# Altium project DreamLight.PrjPcb
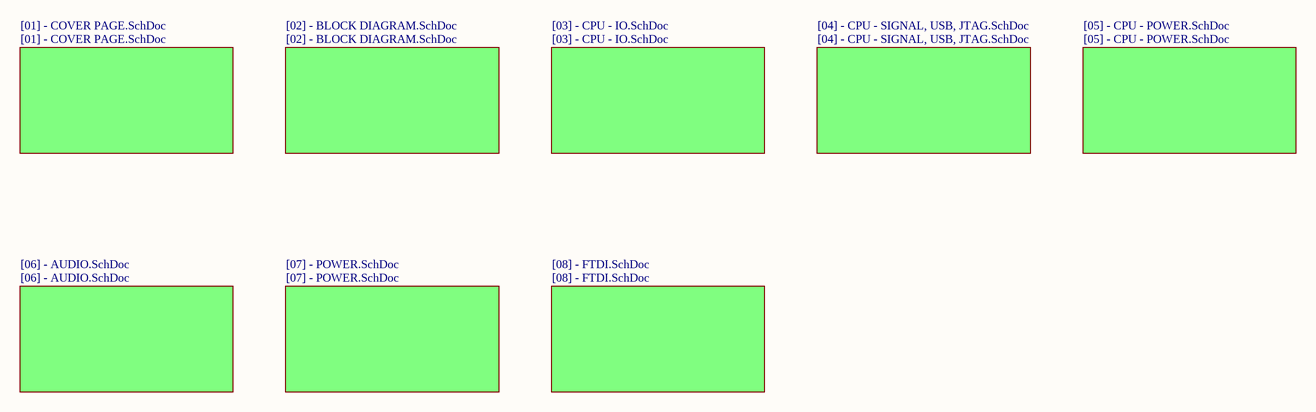
[diagram p0: DreamLight v1.SchDoc]
Title: LKJkljnksdsdv
9 sheets, 126 parts. Net scope: flat (ports and power ports of the same name join across sheets).
Board file: PCB.PcbDoc
Sheets:
  DreamLight v1.SchDoc
    [01] - COVER PAGE.SchDoc = [01] - COVER PAGE.SchDoc
    [02] - BLOCK DIAGRAM.SchDoc = [02] - BLOCK DIAGRAM.SchDoc
    [03] - CPU - IO.SchDoc = [03] - CPU - IO.SchDoc
    [04] - CPU - SIGNAL, USB, JTAG.SchDoc = [04] - CPU - SIGNAL, USB, JTAG.SchDoc
    [05] - CPU - POWER.SchDoc = [05] - CPU - POWER.SchDoc
    [06] - AUDIO.SchDoc = [06] - AUDIO.SchDoc
    [07] - POWER.SchDoc = [07] - POWER.SchDoc
    [08] - FTDI.SchDoc = [08] - FTDI.SchDoc

## Sheet DreamLight v1.SchDoc: DOCUMENT TITLE
size A4; Organization: Tor Brodtkorb; Address1: Frode Rinnans veg 193; Address2: 7050 Trondheim; DocumentNumber: 6598; Revision: 1.0; SheetNumber: 1; SheetTotal: 1

### Sub-sheets
[01] - COVER PAGE.SchDoc = [01] - COVER PAGE.SchDoc: no entries
[02] - BLOCK DIAGRAM.SchDoc = [02] - BLOCK DIAGRAM.SchDoc: no entries
[03] - CPU - IO.SchDoc = [03] - CPU - IO.SchDoc: no entries
[04] - CPU - SIGNAL, USB, JTAG.SchDoc = [04] - CPU - SIGNAL, USB, JTAG.SchDoc: no entries
[05] - CPU - POWER.SchDoc = [05] - CPU - POWER.SchDoc: no entries
[06] - AUDIO.SchDoc = [06] - AUDIO.SchDoc: no entries
[07] - POWER.SchDoc = [07] - POWER.SchDoc: no entries
[08] - FTDI.SchDoc = [08] - FTDI.SchDoc: no entries

### Notes on the sheet
- Title
- Size:
- Date:
- A4
- Number:
- Time:
- Revision:
- Sheet
- of
- File:

## Sheet [01] - COVER PAGE.SchDoc: DOCUMENT TITLE
size A4; Organization: Tor Brodtkorb; Address1: Frode Rinnans veg 193; Address2: 7050 Trondheim; DocumentNumber: 6598; Revision: 1.0; SheetNumber: 1; SheetTotal: 1
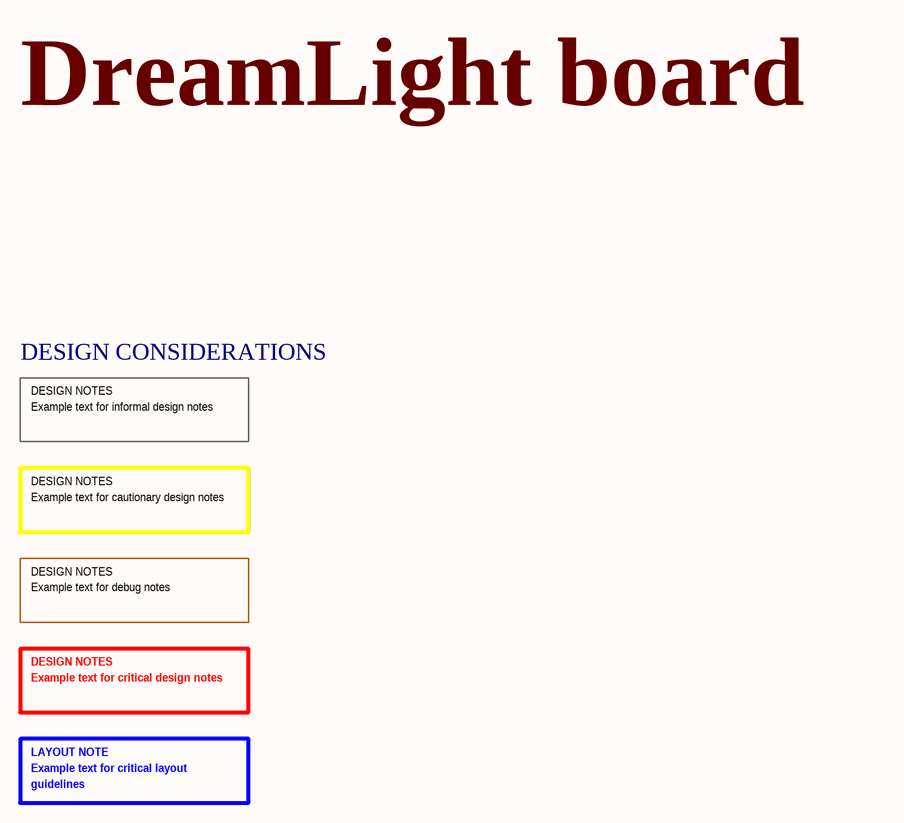
[diagram p1: [01] - COVER PAGE.SchDoc]

### Notes on the sheet
- DreamLight board
- DESIGN CONSIDERATIONS
- DESIGN NOTES
- Example text for informal design notes
- Example text for cautionary design notes
- Example text for debug notes
- Example text for critical design notes
- LAYOUT NOTE
- Example text for critical layout
- guidelines
- Title
- Size:
- Date:
- A4
- Number:
- Time:
- Revision:
- Sheet
- of
- File:

## Sheet [02] - BLOCK DIAGRAM.SchDoc: DOCUMENT TITLE
size A4; Organization: Tor Brodtkorb; Address1: Frode Rinnans veg 193; Address2: 7050 Trondheim; DocumentNumber: 6598; Revision: 1.0; SheetNumber: 1; SheetTotal: 1
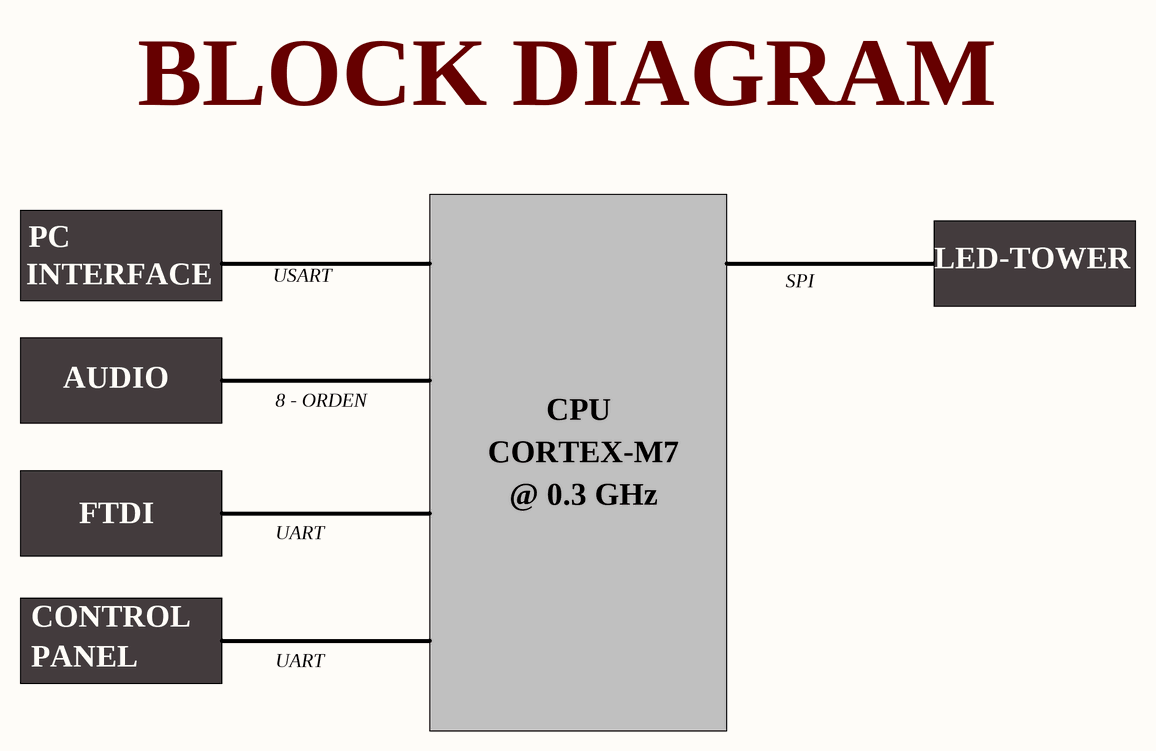
[diagram p2: [02] - BLOCK DIAGRAM.SchDoc]

### Notes on the sheet
- BLOCK DIAGRAM
- PC
- LED-TOWER
- INTERFACE
- USART
- SPI
- AUDIO
- 8 - ORDEN
- CORTEX-M7
- CPU
- FTDI
- UART
- @ 0.3 GHz
- CONTROL
- PANEL
- Title
- Size:
- Date:
- A4
- Number:
- Time:
- Revision:
- Sheet
- of
- File:

## Sheet [03] - CPU - IO.SchDoc: DOCUMENT TITLE
size A4; Organization: Tor Brodtkorb; Address1: Frode Rinnans veg 193; Address2: 7050 Trondheim; DocumentNumber: 6598; Revision: 1.0; SheetNumber: 1; SheetTotal: 1
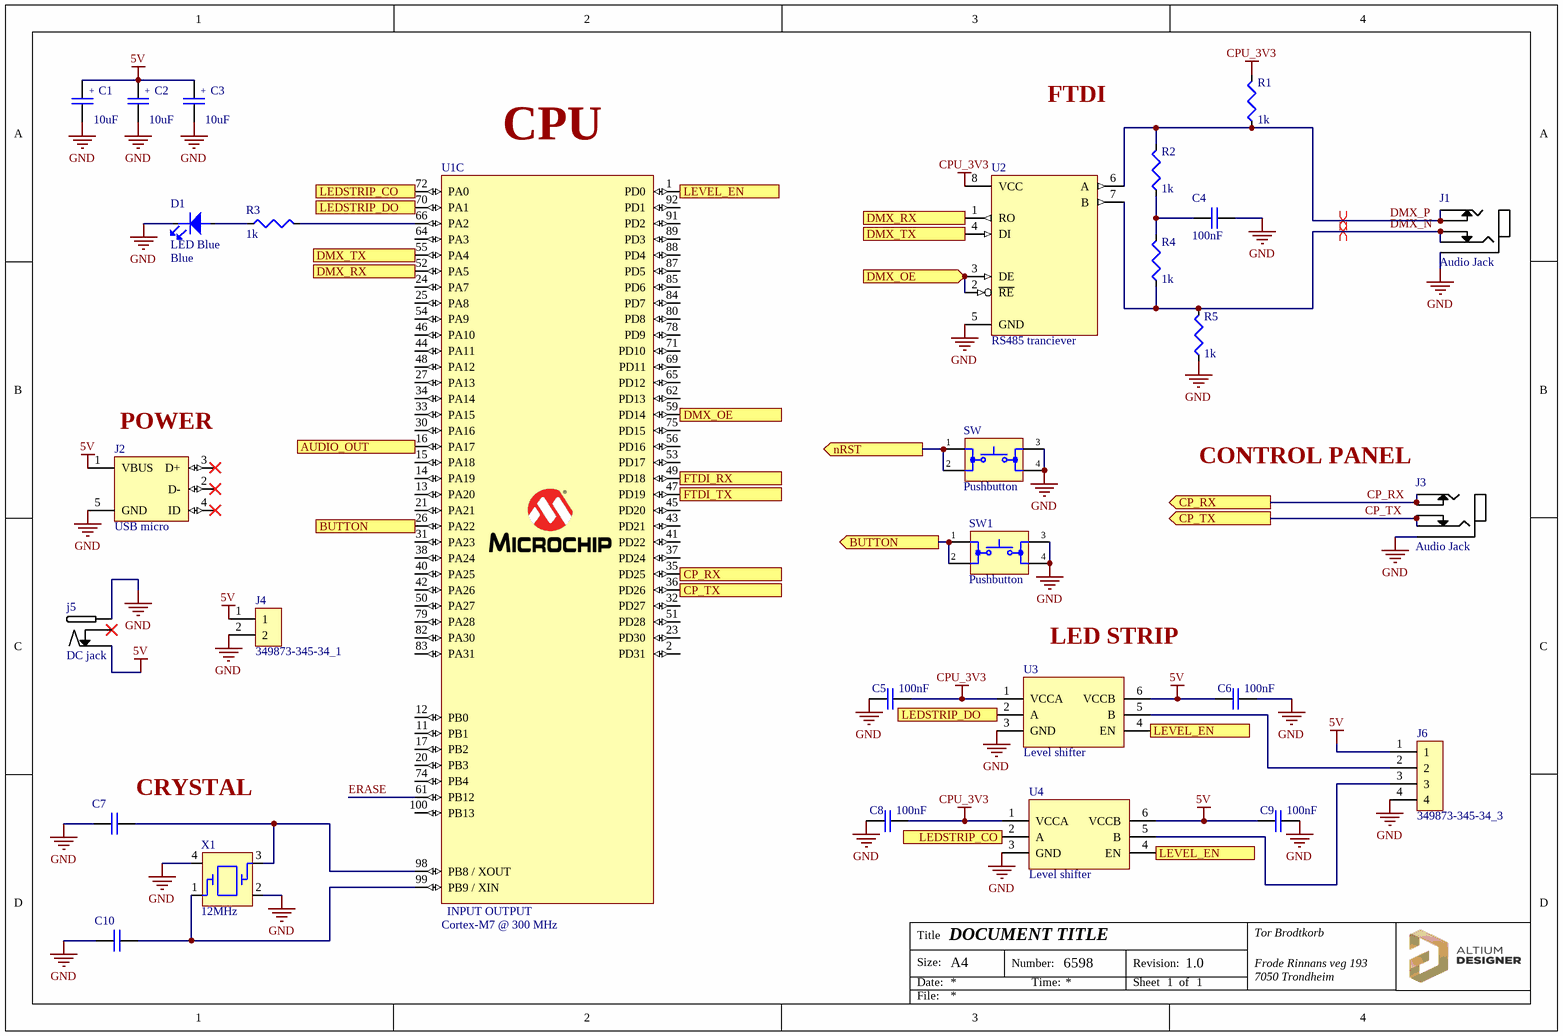
[diagram p3: [03] - CPU - IO.SchDoc]

### Parts
C1  value 10uF  [Capacitor electrolytic SMD 4x5.4]  (hidden comment: EEE1HA2R2SR)
C2  value 10uF  [Capacitor electrolytic SMD 4x5.4]  (hidden comment: EEE1HA2R2SR)
C3  value 10uF  [Capacitor electrolytic SMD 4x5.4]  (hidden comment: EEE1HA2R2SR)
C4  value 100nF  [C0603]  (hidden comment: 02016D104KAT2A)
C5  value 100nF  [C0603]  (hidden comment: 02016D104KAT2A)
C6  value 100nF  [C0603]  (hidden comment: 02016D104KAT2A)
C7  02016D104KAT2A  [C0603]  (value not drawn)
C8  value 100nF  [C0603]  (hidden comment: 02016D104KAT2A)
C9  value 100nF  [C0603]  (hidden comment: 02016D104KAT2A)
C10  02016D104KAT2A  [C0603]  (value not drawn)
D1  LED Blue  Color: Blue  [L0603 BLUE]
J1  Audio Jack  [Audio jack flat]
J2  USB micro  [USB micro]
J3  Audio Jack  [Audio jack flat]
J4  349873-345-34_1  [Header 1x2 male]
j5  DC jack  [DC power jack]
J6  349873-345-34_3  [Header 1x4 male]
R1  value 1k  [R0603]  (hidden comment: CPF-A-0603B100KE1)
R2  value 1k  [R0603]  (hidden comment: CPF-A-0603B100KE1)
R3  value 1k  [R0603]  (hidden comment: CPF-A-0603B100KE1)
R4  value 1k  [R0603]  (hidden comment: CPF-A-0603B100KE1)
R5  value 1k  [R0603]  (hidden comment: CPF-A-0603B100KE1)
SW  Pushbutton  [KSC222G LFS]
SW1  Pushbutton  [KSC222G LFS]
U1  Cortex-M7 @ 300 MHz  [ATSAMS70N19A-AN]  (part C of 3)
U2  RS485 tranciever  [SP3485EN]
U3  Level shifter  [ADG3301BKSZ]
U4  Level shifter  [ADG3301BKSZ]
X1  12MHz  [MCSJK-7U-12.00-12-30-80-B-30]

### Ports
AUDIO_OUT (in), BUTTON (in), BUTTON (out), CP_RX (out), CP_TX (out), DMX_OE (in), DMX_OE (out), DMX_RX (in), DMX_RX (out), DMX_TX (in), DMX_TX (out), FTDI_RX (out), FTDI_TX (out), LEDSTRIP_CO (in), LEDSTRIP_CO (out), LEDSTRIP_DO (in), LEDSTRIP_DO (out), LEVEL_EN (in), LEVEL_EN (out), nRST (out)

### Nets
5V: C1.1 C2.1 C3.1 C6.1 C9.1 J2.1(VBUS) J4.1 j5.1 J6.1 U3.6(VCCB) U4.6(VCCB)
CPU_3V3: C5.2 C8.2 R1.2 U2.8(VCC) U3.1(VCCA) U4.1(VCCA)
GND: C1.2 C2.2 C3.2 C4.1 C5.1 C6.2 C7.2 C8.1 C9.2 C10.2 D1.2 J1.1 J2.5(GND) J3.1 J4.2 j5.3 J6.4 R5.1 SW.3 SW.4 SW1.3 SW1.4 U2.5(GND) U3.3(GND) U4.3(GND) X1.2 X1.4
CP_RX: J3.4 J3.5 U1.35(PD25) ; port CP_RX
CP_TX: J3.2 J3.3 U1.36(PD26) ; port CP_TX
DMX_N: J1.2 J1.3 R4.1 R5.2 U2.7(B)
DMX_P: J1.4 J1.5 R1.1 R2.2 U2.6(A)
ERASE: U1.61(PB12)
nRST: SW.1 SW.2 ; port nRST
NetC4_2: C4.2 R2.1 R4.2
NetC7_1: C7.1 U1.98(PB8_/_XOUT) X1.3
NetC10_1: C10.1 U1.99(PB9_/_XIN) X1.1
NetC55_2: U1.16(PA17) ; port AUDIO_OUT
NetD1_1: D1.1 R3.1
NetJ6_2: J6.2 U3.5(B)
NetJ6_3: J6.3 U4.5(B)
NetR3_2: R3.2 U1.66(PA2)
NetSW1_1: SW1.1 SW1.2 U1.26(PA22) ; port BUTTON
NetU1_1: U1.1(PD0) U3.4(EN) U4.4(EN) ; port LEVEL_EN
NetU1_47: U1.47(PD19) ; port FTDI_TX
NetU1_49: U1.49(PD18) ; port FTDI_RX
NetU1_52: U1.52(PA5) U2.1(RO) ; port DMX_RX
NetU1_55: U1.55(PA4) U2.4(DI) ; port DMX_TX
NetU1_59: U1.59(PD14) U2.2(~{RE}) U2.3(DE) ; port DMX_OE
NetU1_70: U1.70(PA1) U3.2(A) ; port LEDSTRIP_DO
NetU1_72: U1.72(PA0) U4.2(A) ; port LEDSTRIP_CO

Not connected (* = marked no-connect by the designer): J2 2(D-)* 3(D+)* 4(ID)*; j5 2*; U1 2(PD31) 11(PB1) 12(PB0) 13(PA20) 14(PA19) 15(PA18) 17(PB2) 20(PB3) 21(PA21) 23(PD30) 24(PA7) 25(PA8) 27(PA13) 30(PA16) 31(PA23) 32(PD27) 33(PA15) 34(PA14) 37(PD24) 38(PA24) 40(PA25) 41(PD22) 42(PA26) 43(PD21) 44(PA11) 45(PD20) 46(PA10) 48(PA12) 50(PA27) 51(PD28) 53(PD17) 54(PA9) 56(PD16) 62(PD13) 64(PA3) 65(PD12) 69(PD11) 71(PD10) 74(PB4) 75(PD15) 78(PD9) 79(PA28) 80(PD8) 82(PA30) 83(PA31) 84(PD7) 85(PD6) 87(PD5) 88(PD4) 89(PD3) 91(PD2) 92(PD1) 100(PB13)

### Layout directives
differential pair: DMX_N, DMX_P

### Notes on the sheet
- FTDI
- (near U1) CPU
- (near J2) POWER
- CONTROL PANEL
- LED STRIP
- (near C7) CRYSTAL
- Title
- Size:
- Date:
- A4
- Number:
- Time:
- Revision:
- Sheet
- of
- File:
- (in symbol ATSAMS70N19A-AN, part C) INPUT OUTPUT
- (in symbol EEE1HA2R2SR) +

### Library data of the parts
C1-C3 = EEE1HA2R2SR: El. Capacitor SMD 4x5.4
C4-C10 = 02016D104KAT2A: C0603
D1 = HSMG-C199: LED 0603 Blue
J1 J3 = FC68133: Audio jack flat 5 contacts; Supplier Part Number 1: 2518190; Supplier 1: Farnell
J2 = 47590-0001: Supplier Part Number 1: 1568022; Supplier 1: Farnell
J4 = 349873-345-34_1: Header 1x2 male 2.54mm
j5 = 694106301002: DC power jack
J6 = 349873-345-34_3: Header 1x4 male 2.54mm
R1-R5 = CPF-A-0603B100KE1: R0603
SW SW1 = KSC222G LFS: Pushbutton SMD; Supplier Part Number 1: 2845714; Supplier 1: Farnell
U1 = ATSAMS70N19A-AN: ATSAMS70N19; Supplier Part Number 1: 2484390; Supplier 1: Farnell
U2 = SP3485EN: RS485 tranciever 3V3
U3 U4 = ADG3301BKSZ: Level shifter 1-bit bidirectional
X1 = MCSJK-7U-12.00-12-30-80-B-30: Crystal 12MHz 3.2mm x 2.5mm; Supplier Part Number 1: 2853917; Supplier 1: Farnell

## Sheet [04] - CPU - SIGNAL, USB, JTAG.SchDoc: DOCUMENT TITLE
size A4; Organization: Tor Brodtkorb; Address1: Frode Rinnans veg 193; Address2: 7050 Trondheim; DocumentNumber: 6598; Revision: 1.0; SheetNumber: 1; SheetTotal: 1
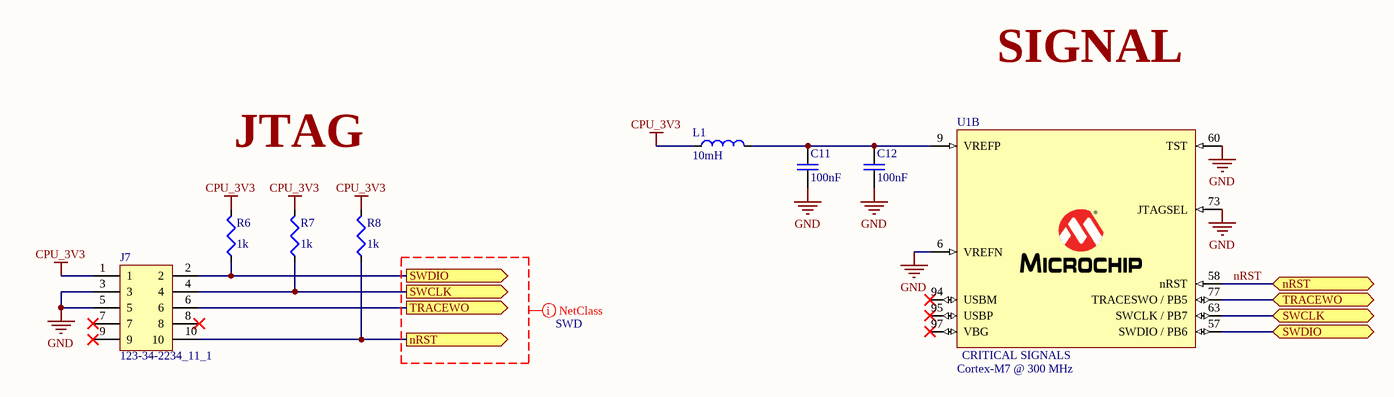
[diagram p4: [04] - CPU - SIGNAL, USB, JTAG.SchDoc]

### Parts
C11  value 100nF  [C0603]  (hidden comment: 02016D104KAT2A)
C12  value 100nF  [C0603]  (hidden comment: 02016D104KAT2A)
J7  123-34-2234_11_1  [Header 2x5 male 1.27mm]
L1  value 10mH  [Inductor 0603]  (hidden comment: MLZ1608A2R2WT)
R6  value 1k  [R0603]  (hidden comment: CPF-A-0603B100KE1)
R7  value 1k  [R0603]  (hidden comment: CPF-A-0603B100KE1)
R8  value 1k  [R0603]  (hidden comment: CPF-A-0603B100KE1)
U1  Cortex-M7 @ 300 MHz  [ATSAMS70N19A-AN]  (part B of 3)

### Ports
nRST (bidir), nRST (out), SWCLK (bidir), SWCLK (out), SWDIO (bidir), SWDIO (out), TRACEWO (bidir), TRACEWO (out)

### Nets
CPU_3V3: J7.1 L1.1 R6.2 R7.2 R8.2
GND: C11.1 C12.1 J7.3 J7.5 U1.6(VREFN) U1.60(TST) U1.73(JTAGSEL)
nRST: J7.10 R8.1 U1.58(nRST) ; port nRST
NetC11_2: C11.2 C12.2 L1.2 U1.9(VREFP)
NetJ7_2: J7.2 R6.1 U1.57(SWDIO_/_PB6) ; port SWDIO
NetJ7_4: J7.4 R7.1 U1.63(SWCLK_/_PB7) ; port SWCLK
NetJ7_6: J7.6 U1.77(TRACESWO_/_PB5) ; port TRACEWO

Not connected (* = marked no-connect by the designer): J7 7* 8* 9*; U1 94(USBM)* 95(USBP)* 97(VBG)*

### Layout directives
net class SWD: (no net found under the mark)

### Notes on the sheet
- SIGNAL
- JTAG
- Title
- Size:
- Date:
- A4
- Number:
- Time:
- Revision:
- Sheet
- of
- File:
- (in symbol ATSAMS70N19A-AN, part B) CRITICAL SIGNALS

### Library data of the parts
C11 C12 = 02016D104KAT2A: C0603
J7 = 123-34-2234_11_1: Header 2x5 male 1.27mm
L1 = MLZ1608A2R2WT: Inductor 0603
R6-R8 = CPF-A-0603B100KE1: R0603
U1 = ATSAMS70N19A-AN: ATSAMS70N19; Supplier Part Number 1: 2484390; Supplier 1: Farnell

## Sheet [05] - CPU - POWER.SchDoc: DOCUMENT TITLE
size A4; Organization: Tor Brodtkorb; Address1: Frode Rinnans veg 193; Address2: 7050 Trondheim; DocumentNumber: 6598; Revision: 1.0; SheetNumber: 1; SheetTotal: 1
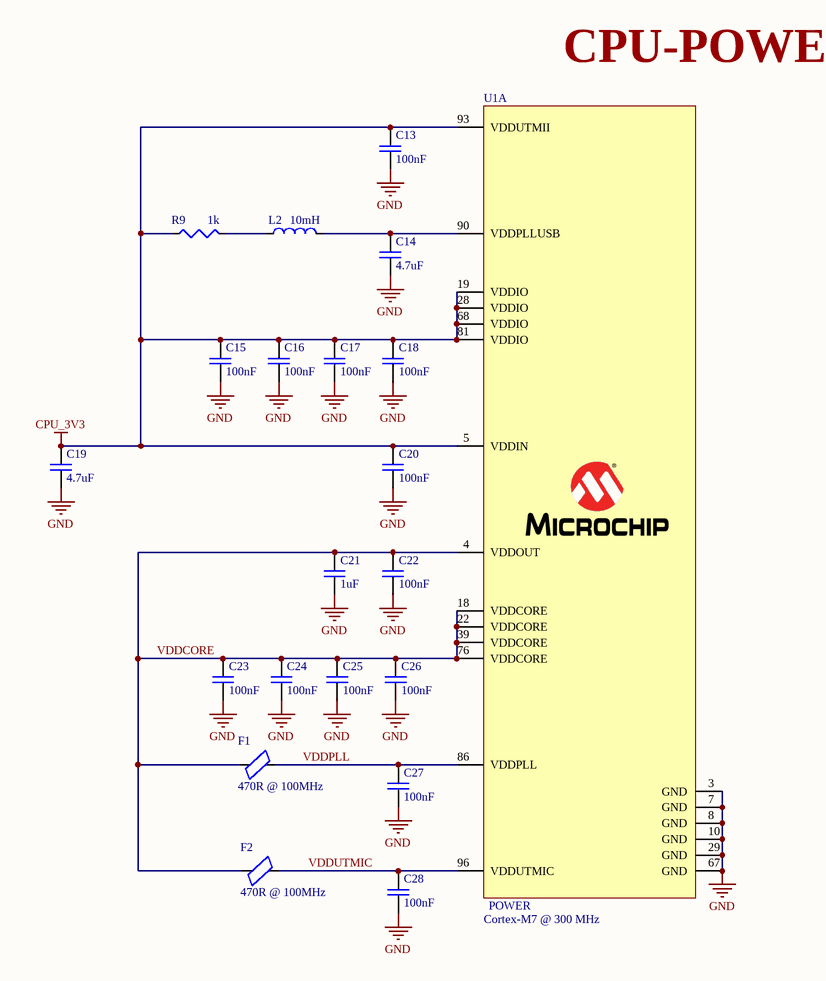
[diagram p5: [05] - CPU - POWER.SchDoc]

### Parts
C13  value 100nF  [C0603]  (hidden comment: 02016D104KAT2A)
C14  value 4.7uF  [C0603]  (hidden comment: 02016D104KAT2A)
C15  value 100nF  [C0603]  (hidden comment: 02016D104KAT2A)
C16  value 100nF  [C0603]  (hidden comment: 02016D104KAT2A)
C17  value 100nF  [C0603]  (hidden comment: 02016D104KAT2A)
C18  value 100nF  [C0603]  (hidden comment: 02016D104KAT2A)
C19  value 4.7uF  [C0603]  (hidden comment: 02016D104KAT2A)
C20  value 100nF  [C0603]  (hidden comment: 02016D104KAT2A)
C21  value 1uF  [C0603]  (hidden comment: 02016D104KAT2A)
C22  value 100nF  [C0603]  (hidden comment: 02016D104KAT2A)
C23  value 100nF  [C0603]  (hidden comment: 02016D104KAT2A)
C24  value 100nF  [C0603]  (hidden comment: 02016D104KAT2A)
C25  value 100nF  [C0603]  (hidden comment: 02016D104KAT2A)
C26  value 100nF  [C0603]  (hidden comment: 02016D104KAT2A)
C27  value 100nF  [C0603]  (hidden comment: 02016D104KAT2A)
C28  value 100nF  [C0603]  (hidden comment: 02016D104KAT2A)
F1  value 470R @ 100MHz  [Ferrite bead 0603]  (hidden comment: BLM18AG121SN1D)
F2  value 470R @ 100MHz  [Ferrite bead 0603]  (hidden comment: BLM18AG121SN1D)
L2  value 10mH  [Inductor 0603]  (hidden comment: MLZ1608A2R2WT)
R9  value 1k  [R0603]  (hidden comment: CPF-A-0603B100KE1)
U1  Cortex-M7 @ 300 MHz  [ATSAMS70N19A-AN]  (part A of 3)

### Nets
CPU_3V3: C13.2 C15.2 C16.2 C17.2 C18.2 C19.2 C20.2 R9.1 U1.5(VDDIN) U1.19(VDDIO) U1.28(VDDIO) U1.68(VDDIO) U1.81(VDDIO) U1.93(VDDUTMII)
GND: C13.1 C14.1 C15.1 C16.1 C17.1 C18.1 C19.1 C20.1 C21.1 C22.1 C23.1 C24.1 C25.1 C26.1 C27.1 C28.1 U1.3(GND) U1.7(GND) U1.8(GND) U1.10(GND) U1.29(GND) U1.67(GND)
VDDCORE: C21.2 C22.2 C23.2 C24.2 C25.2 C26.2 F1.1 F2.1 U1.4(VDDOUT) U1.18(VDDCORE) U1.22(VDDCORE) U1.39(VDDCORE) U1.76(VDDCORE)
VDDPLL: C27.2 F1.2 U1.86(VDDPLL)
VDDUTMIC: C28.2 F2.2 U1.96(VDDUTMIC)
NetC14_2: C14.2 L2.2 U1.90(VDDPLLUSB)
NetL2_1: L2.1 R9.2

### Notes on the sheet
- (near U1) CPU-POWER
- Title
- Size:
- Date:
- A4
- Number:
- Time:
- Revision:
- Sheet
- of
- File:
- (in symbol ATSAMS70N19A-AN, part A) POWER

### Library data of the parts
C13-C28 = 02016D104KAT2A: C0603
F1 F2 = BLM18AG121SN1D: Ferrite bead 0603
L2 = MLZ1608A2R2WT: Inductor 0603
R9 = CPF-A-0603B100KE1: R0603
U1 = ATSAMS70N19A-AN: ATSAMS70N19; Supplier Part Number 1: 2484390; Supplier 1: Farnell

## Sheet [06] - AUDIO.SchDoc: DOCUMENT TITLE
size A3; Organization: Tor Brodtkorb; Address1: Frode Rinnans veg 193; Address2: 7050 Trondheim; DocumentNumber: 6598; Revision: 1.0; SheetNumber: 1; SheetTotal: 1
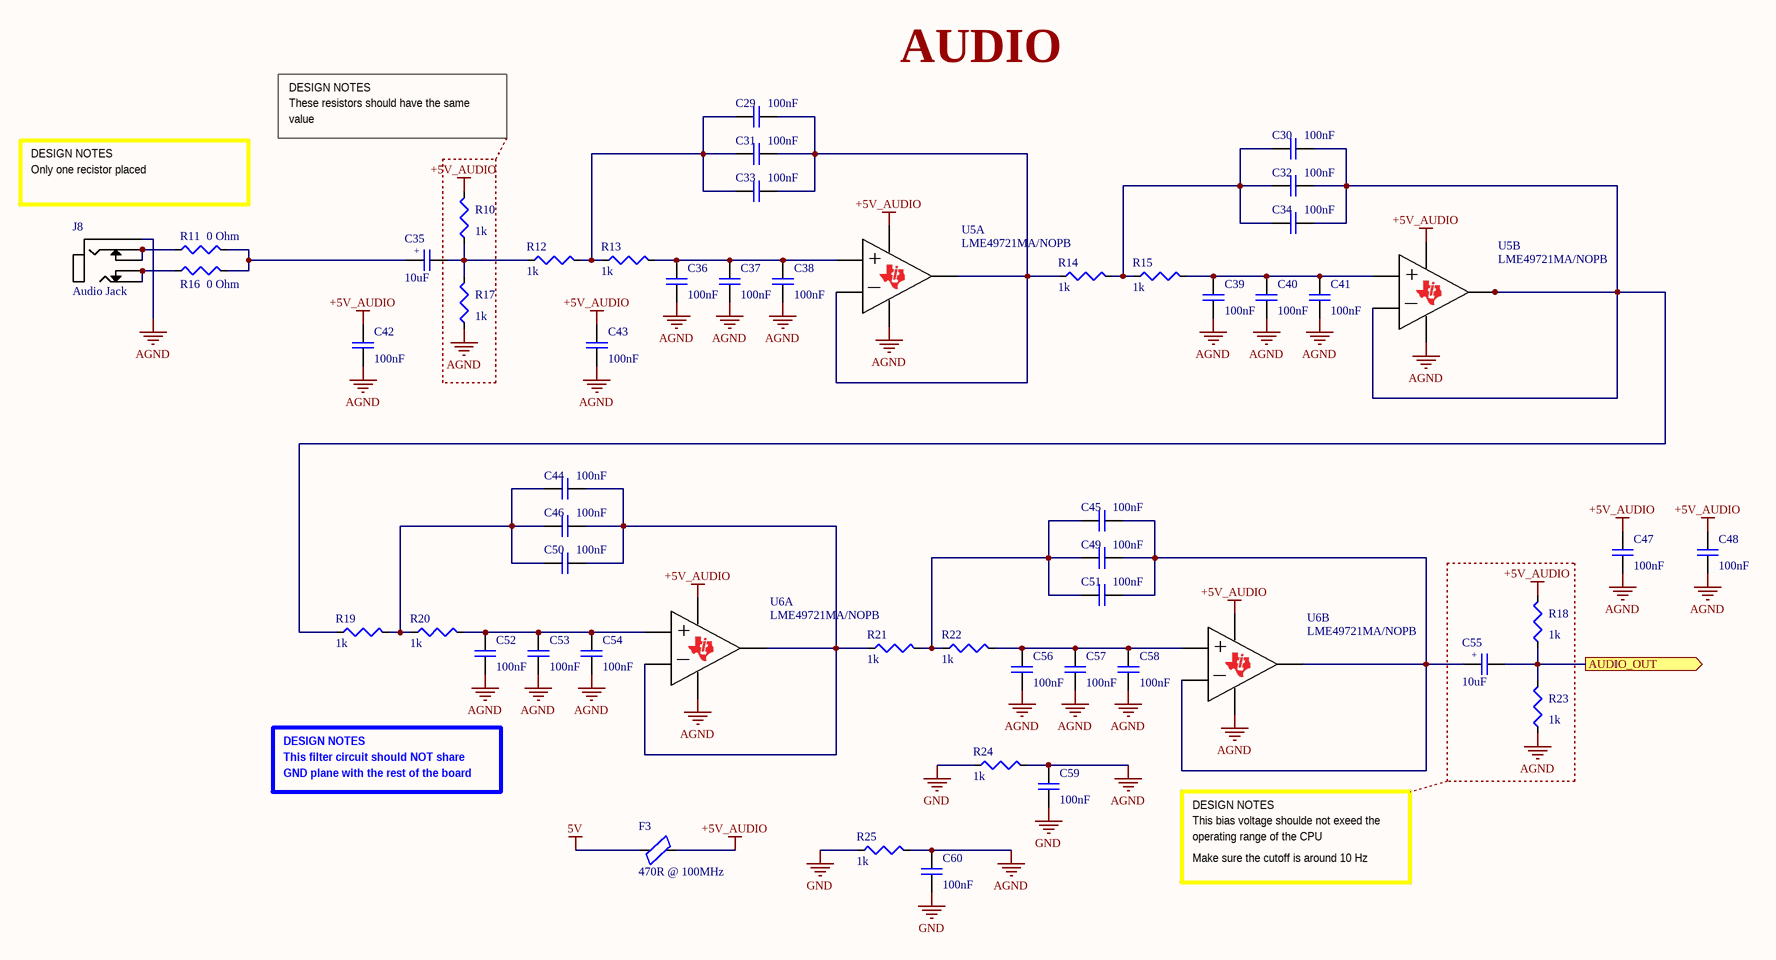
[diagram p6: [06] - AUDIO.SchDoc]

### Parts
C29  value 100nF  [C0603]  (hidden comment: 02016D104KAT2A)
C30  value 100nF  [C0603]  (hidden comment: 02016D104KAT2A)
C31  value 100nF  [C0603]  (hidden comment: 02016D104KAT2A)
C32  value 100nF  [C0603]  (hidden comment: 02016D104KAT2A)
C33  value 100nF  [C0603]  (hidden comment: 02016D104KAT2A)
C34  value 100nF  [C0603]  (hidden comment: 02016D104KAT2A)
C35  value 10uF  [Capacitor electrolytic SMD 4x5.4]  (hidden comment: EEE1HA2R2SR)
C36  value 100nF  [C0603]  (hidden comment: 02016D104KAT2A)
C37  value 100nF  [C0603]  (hidden comment: 02016D104KAT2A)
C38  value 100nF  [C0603]  (hidden comment: 02016D104KAT2A)
C39  value 100nF  [C0603]  (hidden comment: 02016D104KAT2A)
C40  value 100nF  [C0603]  (hidden comment: 02016D104KAT2A)
C41  value 100nF  [C0603]  (hidden comment: 02016D104KAT2A)
C42  value 100nF  [C0603]  (hidden comment: 02016D104KAT2A)
C43  value 100nF  [C0603]  (hidden comment: 02016D104KAT2A)
C44  value 100nF  [C0603]  (hidden comment: 02016D104KAT2A)
C45  value 100nF  [C0603]  (hidden comment: 02016D104KAT2A)
C46  value 100nF  [C0603]  (hidden comment: 02016D104KAT2A)
C47  value 100nF  [C0603]  (hidden comment: 02016D104KAT2A)
C48  value 100nF  [C0603]  (hidden comment: 02016D104KAT2A)
C49  value 100nF  [C0603]  (hidden comment: 02016D104KAT2A)
C50  value 100nF  [C0603]  (hidden comment: 02016D104KAT2A)
C51  value 100nF  [C0603]  (hidden comment: 02016D104KAT2A)
C52  value 100nF  [C0603]  (hidden comment: 02016D104KAT2A)
C53  value 100nF  [C0603]  (hidden comment: 02016D104KAT2A)
C54  value 100nF  [C0603]  (hidden comment: 02016D104KAT2A)
C55  value 10uF  [Capacitor electrolytic SMD 4x5.4]  (hidden comment: EEE1HA2R2SR)
C56  value 100nF  [C0603]  (hidden comment: 02016D104KAT2A)
C57  value 100nF  [C0603]  (hidden comment: 02016D104KAT2A)
C58  value 100nF  [C0603]  (hidden comment: 02016D104KAT2A)
C59  value 100nF  [C0603]  (hidden comment: 02016D104KAT2A)
C60  value 100nF  [C0603]  (hidden comment: 02016D104KAT2A)
F3  value 470R @ 100MHz  [Ferrite bead 0603]  (hidden comment: BLM18AG121SN1D)
J8  Audio Jack  [Audio jack flat]
R10  value 1k  [R0603]  (hidden comment: CPF-A-0603B100KE1)
R11  value 0 Ohm  [R0603]  (hidden comment: CPF-A-0603B100KE1)
R12  value 1k  [R0603]  (hidden comment: CPF-A-0603B100KE1)
R13  value 1k  [R0603]  (hidden comment: CPF-A-0603B100KE1)
R14  value 1k  [R0603]  (hidden comment: CPF-A-0603B100KE1)
R15  value 1k  [R0603]  (hidden comment: CPF-A-0603B100KE1)
R16  value 0 Ohm  [R0603]  (hidden comment: CPF-A-0603B100KE1)
R17  value 1k  [R0603]  (hidden comment: CPF-A-0603B100KE1)
R18  value 1k  [R0603]  (hidden comment: CPF-A-0603B100KE1)
R19  value 1k  [R0603]  (hidden comment: CPF-A-0603B100KE1)
R20  value 1k  [R0603]  (hidden comment: CPF-A-0603B100KE1)
R21  value 1k  [R0603]  (hidden comment: CPF-A-0603B100KE1)
R22  value 1k  [R0603]  (hidden comment: CPF-A-0603B100KE1)
R23  value 1k  [R0603]  (hidden comment: CPF-A-0603B100KE1)
R24  value 1k  [R0603]  (hidden comment: CPF-A-0603B100KE1)
R25  value 1k  [R0603]  (hidden comment: CPF-A-0603B100KE1)
U5  LME49721MA/NOPB  [LME49721MA/NOPB]  (parts A,B of 2)
U6  LME49721MA/NOPB  [LME49721MA/NOPB]  (parts A,B of 2)

### Ports
AUDIO_OUT (out)

### Nets
5V: F3.1
+5V_AUDIO: C42.2 C43.2 C47.2 C48.2 F3.2 R10.2 R18.2 U5.8(VDD) U6.8(VDD)
AGND: C36.1 C37.1 C38.1 C39.1 C40.1 C41.1 C42.1 C43.1 C47.1 C48.1 C52.1 C53.1 C54.1 C56.1 C57.1 C58.1 C59.2 C60.2 J8.1 R17.1 R23.1 R24.2 R25.2 U5.4(VDD) U6.4(VDD)
GND: C59.1 C60.1 R24.1 R25.1
NetC29_1: C29.1 C31.1 C33.1 R12.2 R13.1
NetC29_2: C29.2 C31.2 C33.2 R14.1 U5.1(VDD) U5.2(VDD)
NetC30_1: C30.1 C32.1 C34.1 R14.2 R15.1
NetC30_2: C30.2 C32.2 C34.2 R19.1 U5.6(VDD) U5.7(VDD)
NetC35_1: C35.1 R11.2 R16.2
NetC35_2: C35.2 R10.1 R12.1 R17.2
NetC36_2: C36.2 C37.2 C38.2 R13.2 U5.3(VDD)
NetC39_2: C39.2 C40.2 C41.2 R15.2 U5.5(VDD)
NetC44_1: C44.1 C46.1 C50.1 R19.2 R20.1
NetC44_2: C44.2 C46.2 C50.2 R21.1 U6.1(VDD) U6.2(VDD)
NetC45_1: C45.1 C49.1 C51.1 R21.2 R22.1
NetC45_2: C45.2 C49.2 C51.2 C55.1 U6.6(VDD) U6.7(VDD)
NetC52_2: C52.2 C53.2 C54.2 R20.2 U6.3(VDD)
NetC55_2: C55.2 R18.1 R23.2 ; port AUDIO_OUT
NetC56_2: C56.2 C57.2 C58.2 R22.2 U6.5(VDD)
NetJ8_2: J8.2 J8.3 R11.1
NetJ8_4: J8.4 J8.5 R16.1

### Notes on the sheet
- DESIGN NOTES
- These resistors should have the same
- value
- AUDIO
- Only one recistor placed
- This filter circuit should NOT share
- GND plane with the rest of the board
- This bias voltage shoulde not exeed the
- operating range of the CPU
- Make sure the cutoff is around 10 Hz
- Title
- Size:
- Date:
- A3
- Number:
- Time:
- Revision:
- Sheet
- of
- File:
- (in symbol EEE1HA2R2SR) +
- (in symbol LME49721MA/NOPB, part A) +; _
- (in symbol LME49721MA/NOPB, part B) +; _

### Library data of the parts
C29-C34 C36-C54 C56-C60 = 02016D104KAT2A: C0603
C35 C55 = EEE1HA2R2SR: El. Capacitor SMD 4x5.4
F3 = BLM18AG121SN1D: Ferrite bead 0603
J8 = FC68133: Audio jack flat 5 contacts; Supplier Part Number 1: 2518190; Supplier 1: Farnell
R10-R25 = CPF-A-0603B100KE1: R0603
U5 U6 = LME49721MA/NOPB: Audio OP amp, single supply, low voltage

## Sheet [07] - POWER.SchDoc: DOCUMENT TITLE
size A4; Organization: Tor Brodtkorb; Address1: Frode Rinnans veg 193; Address2: 7050 Trondheim; DocumentNumber: 6598; Revision: 1.0; SheetNumber: 1; SheetTotal: 1
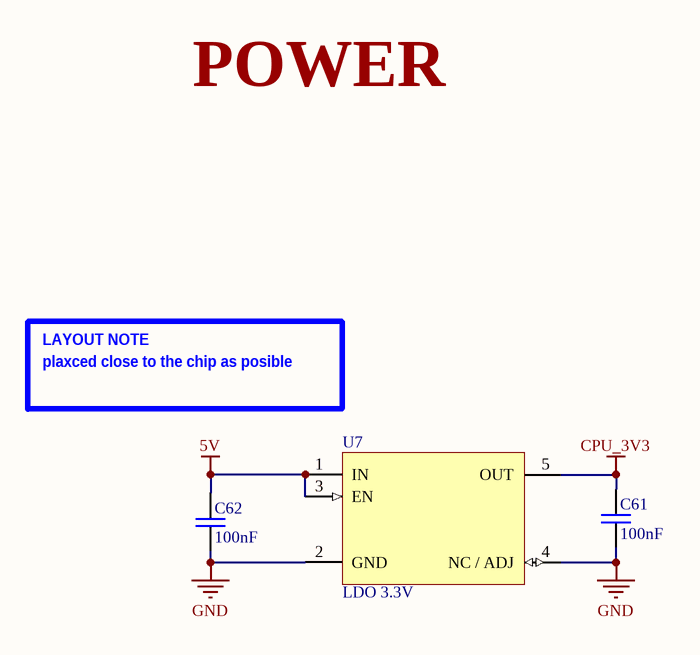
[diagram p7: [07] - POWER.SchDoc]

### Parts
C61  value 100nF  [C0603]  (hidden comment: 02016D104KAT2A)
C62  value 100nF  [C0603]  (hidden comment: 02016D104KAT2A)
U7  LDO 3.3V  [NCV8161BSN330T1G]

### Nets
5V: C62.2 U7.1(IN) U7.3(EN)
CPU_3V3: C61.2 U7.5(OUT)
GND: C61.1 C62.1 U7.2(GND) U7.4(NC_/_ADJ)

### Notes on the sheet
- POWER
- LAYOUT NOTE
- plaxced close to the chip as posible
- Title
- Size:
- Date:
- A4
- Number:
- Time:
- Revision:
- Sheet
- of
- File:

### Library data of the parts
C61 C62 = 02016D104KAT2A: C0603
U7 = NCV8161BSN330T1G: LDO fixed 3.3V 450mA ultra-low noise; RMS noise: < 100 uVrms; Dropout voltage: 330mV; Supplier Part Number 1: 2775470; Supplier 1: Farnell; Output voltage: 3.3V; Output current: 450mA

## Sheet [08] - FTDI.SchDoc: DOCUMENT TITLE
size A4; Organization: Tor Brodtkorb; Address1: Frode Rinnans veg 193; Address2: 7050 Trondheim; DocumentNumber: 6598; Revision: 1.0; SheetNumber: 1; SheetTotal: 1
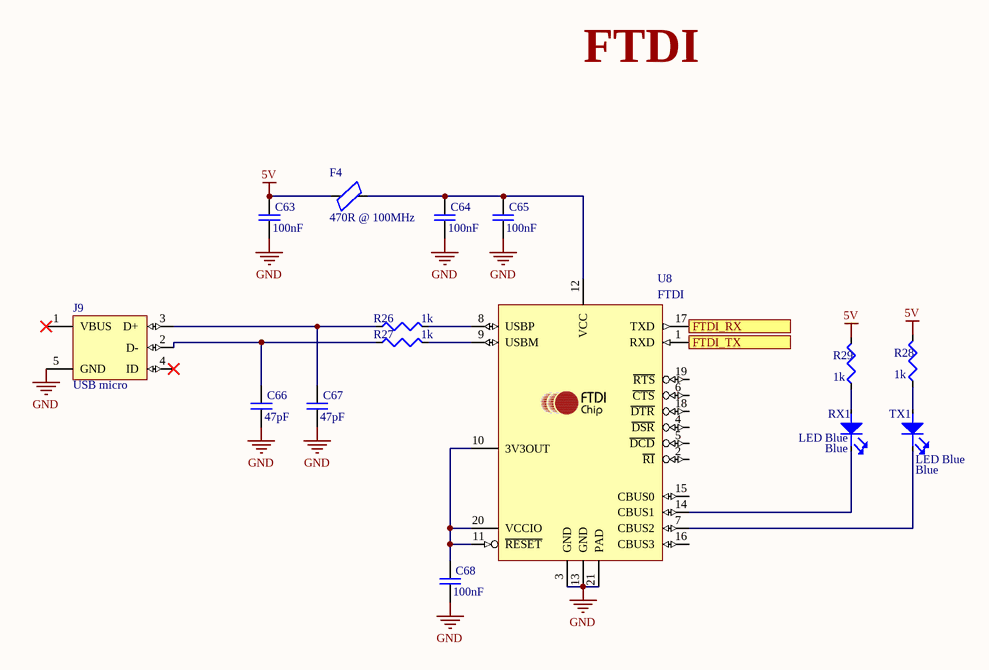
[diagram p8: [08] - FTDI.SchDoc]

### Parts
C63  value 100nF  [C0603]  (hidden comment: 02016D104KAT2A)
C64  value 100nF  [C0603]  (hidden comment: 02016D104KAT2A)
C65  value 100nF  [C0603]  (hidden comment: 02016D104KAT2A)
C66  value 47pF  [C0603]  (hidden comment: 02016D104KAT2A)
C67  value 47pF  [C0603]  (hidden comment: 02016D104KAT2A)
C68  value 100nF  [C0603]  (hidden comment: 02016D104KAT2A)
F4  value 470R @ 100MHz  [Ferrite bead 0603]  (hidden comment: BLM18AG121SN1D)
J9  USB micro  [USB micro]
R26  value 1k  [R0603]  (hidden comment: CPF-A-0603B100KE1)
R27  value 1k  [R0603]  (hidden comment: CPF-A-0603B100KE1)
R28  value 1k  [R0603]  (hidden comment: CPF-A-0603B100KE1)
R29  value 1k  [R0603]  (hidden comment: CPF-A-0603B100KE1)
RX1  LED Blue  Color: Blue  [L0603 BLUE]
TX1  LED Blue  Color: Blue  [L0603 BLUE]
U8  FTDI  [FT231XQ-R]

### Ports
FTDI_RX (out), FTDI_TX (in)

### Nets
5V: C63.2 F4.1 R28.2 R29.2
GND: C63.1 C64.1 C65.1 C66.1 C67.1 C68.1 J9.5(GND) U8.3(GND) U8.13(GND) U8.21(PAD)
NetC64_2: C64.2 C65.2 F4.2 U8.12(VCC)
NetC66_2: C66.2 J9.2(D-) R27.1
NetC67_2: C67.2 J9.3(D+) R26.1
NetC68_2: C68.2 U8.10(3V3OUT) U8.11(~{RESET}) U8.20(VCCIO)
NetR26_2: R26.2 U8.8(USBP)
NetR27_2: R27.2 U8.9(USBM)
NetR28_1: R28.1 TX1.1
NetR29_1: R29.1 RX1.1
NetRX1_2: RX1.2 U8.14(CBUS1)
NetTX1_2: TX1.2 U8.7(CBUS2)
NetU1_47: U8.1(RXD) ; port FTDI_TX
NetU1_49: U8.17(TXD) ; port FTDI_RX

Not connected (* = marked no-connect by the designer): J9 1(VBUS)* 4(ID)*; U8 2(~{RI}) 4(~{DSR}) 5(~{DCD}) 6(~{CTS}) 15(CBUS0) 16(CBUS3) 18(~{DTR}) 19(~{RTS})

### Notes on the sheet
- FTDI
- Title
- Size:
- Date:
- A4
- Number:
- Time:
- Revision:
- Sheet
- of
- File:

### Library data of the parts
C63-C68 = 02016D104KAT2A: C0603
F4 = BLM18AG121SN1D: Ferrite bead 0603
J9 = 47590-0001: Supplier Part Number 1: 1568022; Supplier 1: Farnell
R26-R29 = CPF-A-0603B100KE1: R0603
RX1 TX1 = HSMG-C199: LED 0603 Blue
U8 = FT231XQ-R: USB to RS-232 converter; Supplier Part Number 1: 2081330; Supplier 1: Farnell

## Nets that join several sheets
5V: [03] - CPU - IO (11 pins), [06] - AUDIO (F3.1), [07] - POWER (C62.2 U7.1 U7.3), [08] - FTDI (C63.2 F4.1 R28.2 R29.2)
CPU_3V3: [03] - CPU - IO (6 pins), [04] - CPU - SIGNAL, USB, JTAG (5 pins), [05] - CPU - POWER (14 pins), [07] - POWER (C61.2 U7.5)
GND: [03] - CPU - IO (27 pins), [04] - CPU - SIGNAL, USB, JTAG (7 pins), [05] - CPU - POWER (22 pins), [06] - AUDIO (C59.1 C60.1 R24.1 R25.1), [07] - POWER (C61.1 C62.1 U7.2 U7.4), [08] - FTDI (10 pins)
NetC55_2: [03] - CPU - IO (U1.16), [06] - AUDIO (C55.2 R18.1 R23.2)
NetU1_47: [03] - CPU - IO (U1.47), [08] - FTDI (U8.1)
NetU1_49: [03] - CPU - IO (U1.49), [08] - FTDI (U8.17)
nRST: [03] - CPU - IO (SW.1 SW.2), [04] - CPU - SIGNAL, USB, JTAG (J7.10 R8.1 U1.58)